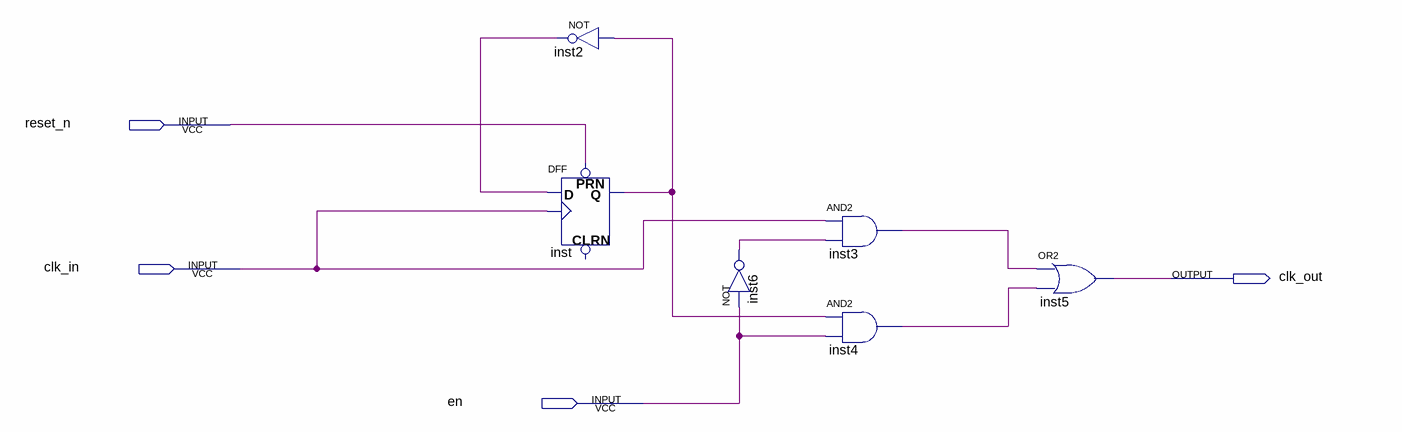
[diagram p0: schematic sheet]
// Quartus schematic clk_div_2.bdf as structural Verilog: 6 symbols, 4 pins
module clk_div_2 (
  input  reset_n,
  input  clk_in,
  input  en,
  output clk_out
);

  wire inst2_out, inst3_out, inst4_out, inst6_out, inst_q;

  not inst2 (inst2_out, inst_q);
  DFF inst (.CLK(clk_in), .D(inst2_out), .PRN(reset_n), .Q(inst_q));  // open: CLRN
  not inst6 (inst6_out, en);
  and inst3 (inst3_out, clk_in, inst6_out);
  and inst4 (inst4_out, inst_q, en);
  or inst5 (clk_out, inst3_out, inst4_out);
endmodule
